# EAGLE schematic SWD_PROGRAMMER_minimal_modified (EAGLE 7.5.0)
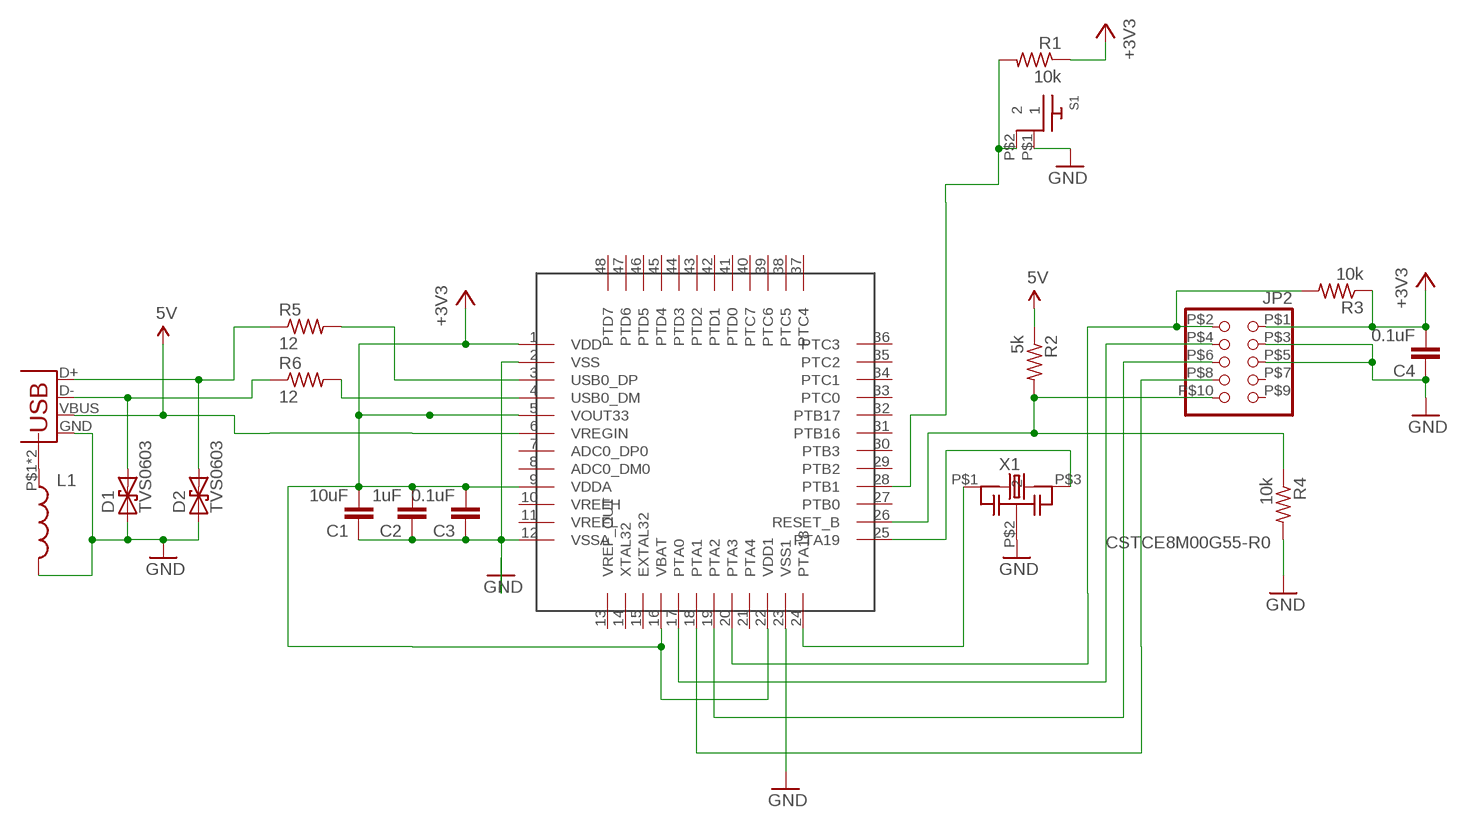
[diagram p0: schematic, sheet 1]

## Parts
C1  10uF  RF-C0805  [C0805]
C2  1uF  RF-C0805  [C0805]
C3  0.1uF  RF-C0805  [C0805]
C4  0.1uF  RF-C0805  [C0805]
D1  TVS0603  [0603-RES]
D2  TVS0603  [0603-RES]
J1  USB_B  [USB-B-PTH-VERTICAL]
JP2  PINHD-2X5SMALL  [2X5HDR]
L1  INDUCTOR0603  [0603]
R1  10k  RF-R0805  [RF-C0805]
R2  5k  RF-R0805  [RF-C0805]
R3  10k  RF-R0805  [RF-C0805]
R4  10k  RF-R0805  [RF-C0805]
R5  12  RF-R0805  [RF-C0805]
R6  12  RF-R0805  [RF-C0805]
S1  RA_BUTTON  [RA_BUTTON]
U$1  KL20_48  [LQFP-48]
X1  CSTCE8M00G55-R0  [CSTCE_G_A]

## Nets
5V: J1.VBUS R2.1 U$1.6(VREGIN)
+3V3: C1.2 C2.2 C3.2 C4.2 JP2.P$1 R1.1 R3.1 U$1.1(VDD) U$1.5(VOUT33) U$1.9(VDDA) U$1.16(VBAT) U$1.22(VDD1)
CLK: JP2.P$4 U$1.17(PTA0)
GND [GND]: C1.1 C2.1 C3.1 C4.1 D1.1 D2.1 J1.GND JP2.P$3 JP2.P$5 L1.2 R4.2 S1.P$1 U$1.2(VSS) U$1.12(VSSA) U$1.23(VSS1) X1.P$2
JRST: JP2.P$10 R2.2 R4.1 U$1.26(RESET_B)
N$1: R6.2 U$1.4(USB0_DM)
N$4: U$1.24(PTA18) X1.P$1
N$5: J1.P$1(SHIELD) J1.P$2(SHIELD) L1.1
N$6: U$1.25(PTA19) X1.P$3
N$9: R5.2 U$1.3(USB0_DP)
N$35: D1.2 J1.D- R6.1
N$36: D2.2 J1.D+ R5.1
RST: R1.2 S1.P$2 U$1.28(PTB1)
TDI: JP2.P$8 U$1.18(PTA1)
TDO: JP2.P$6 U$1.19(PTA2)
TMS: JP2.P$2 R3.2 U$1.20(PTA3)
Unconnected: JP2.P$7 JP2.P$9 U$1.7(ADC0_DP0) U$1.8(ADC0_DM0) U$1.10(VREFH) U$1.11(VREFL) U$1.13(VREF_OUT) U$1.14(XTAL32) U$1.15(EXTAL32) U$1.21(PTA4) U$1.27(PTB0) U$1.29(PTB2) U$1.30(PTB3) U$1.31(PTB16) U$1.32(PTB17) U$1.33(PTC0) U$1.34(PTC1) U$1.35(PTC2) U$1.36(PTC3) U$1.37(PTC4) U$1.38(PTC5) U$1.39(PTC6) U$1.40(PTC7) U$1.41(PTD0) U$1.42(PTD1) U$1.43(PTD2) U$1.44(PTD3) U$1.45(PTD4) U$1.46(PTD5) U$1.47(PTD6) U$1.48(PTD7)

## Library data of the parts
C1 = GW-devices:RF-C: RF capacitor pads for FSL reference design; MFGN: Murata; MFGP: GRM219R61E106KA12D
C2 = GW-devices:RF-C: RF capacitor pads for FSL reference design; MFGN: TDK; MFGP: C2012X5R1E105K125AA
C3 C4 = GW-devices:RF-C: RF capacitor pads for FSL reference design; MFGN: TDK; MFGP: C2012X5R1H104K085AA
D1 D2 = SparkFun:TVS; MFGN: Eaton Bussman; MFGP: 0603ESDA2-TR2
J1 = KW2:USB_B; MFGN: Harwin; MFGP: M701-330442
JP2 = KW2:PINHD-2X5: PIN HEADER; MFGN: Sullins Connector Solutions; MFGP: GRPB052VWVN-RC
L1 = SparkFun:INDUCTOR: Inductors Basic Inductor/Choke - 0603 and 1206. Footprints are not proven and vary greatly between part numbers.; MFGN: TDK; MFGP: MPZ1608S331ATA00
R1-R6 = GW-devices:RF-R: RF resistor pads for FSL reference design; MFGN: Vishay Dale; MFGP: CRCW080510K0FKEA
S1 = KW2:RA_BUTTON
U$1 = KW2:KL20_48
X1 = KW2:CSTCE8M00G55-R0